# EAGLE schematic powerSupply (EAGLE 7.2.0)
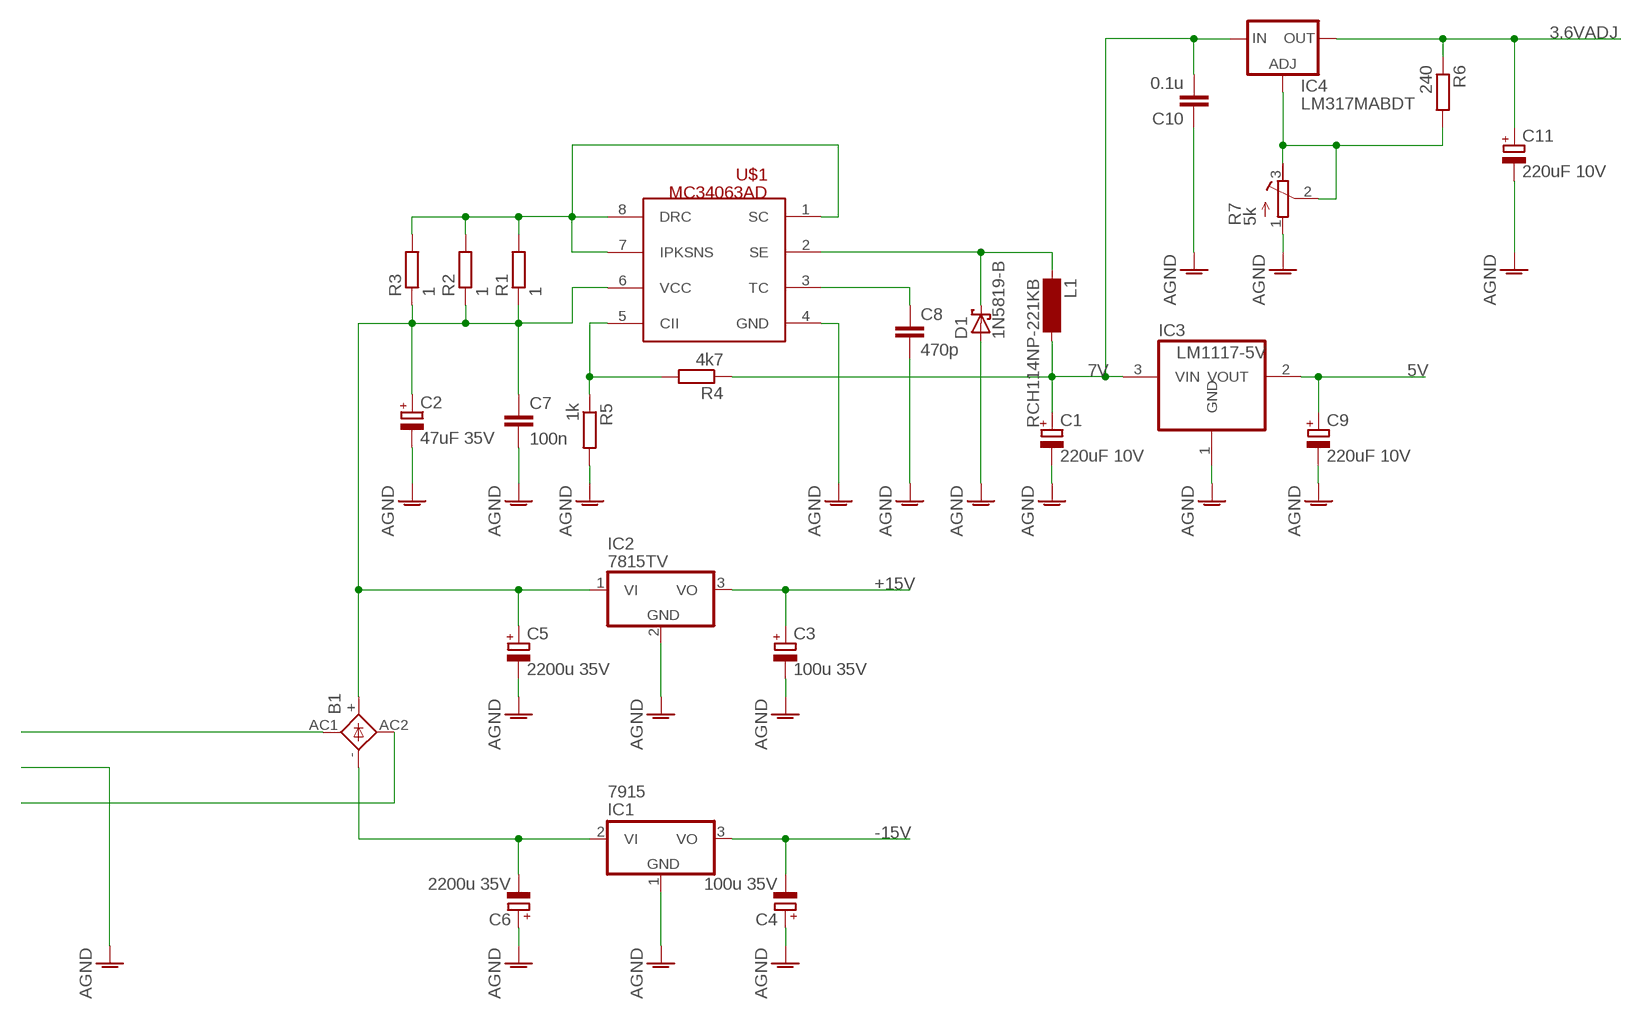
[diagram p0: schematic, sheet 1]

## Parts
B1  2KBP  [2KBP]
C1  220uF 10V  CPOL-EUUD-6,3X8,8  [UD-6,3X5,8_NICHICON]
C2  47uF 35V  CPOL-EUUD-6,3X7,7  [UD-6,3X7,7_NICHICON]
C3  100u 35V  CPOL-EUE3.5-8  [E3,5-8]
C4  100u 35V  CPOL-EUE3.5-8  [E3,5-8]
C5  2200u 35V  CPOL-EUE7.5-16  [E7,5-16]
C6  2200u 35V  CPOL-EUE7.5-16  [E7,5-16]
C7  100n  C-EUC0805  [C0805]
C8  470p  C-EUC0805  [C0805]
C9  220uF 10V  CPOL-EUUD-6,3X8,8  [UD-6,3X5,8_NICHICON]
C10  0.1u  C-EUC0805  [C0805]
C11  220uF 10V  CPOL-EUUD-6,3X8,8  [UD-6,3X5,8_NICHICON]
D1  1N5819-B  [DO41-7.6]
IC1  7915  7915V  [TO220V]
IC2  7815TV  [TO220V]
IC3  LM1117-5V  REG1117  [SOT223]
IC4  LM317MABDT  [DPACK]
L1  RCH114NP-221KB  BS11  [BS11]
R1  1  R-EU_M1206  [M1206]
R2  1  R-EU_M1206  [M1206]
R3  1  R-EU_M1206  [M1206]
R4  4k7  R-EU_M1206  [M1206]
R5  1k  R-EU_M1206  [M1206]
R6  240  R-EU_M1206  [M1206]
R7  5k  R-TRIMM3296W  [RTRIM3296W]
U$1  MC34063AD  [SO-08]

## Nets
3.6VADJ: C11.+ IC4.4(OUT) R6.1
5V: C9.+ IC3.2(VOUT)
7V: C1.+ C10.2 IC3.3(VIN) IC4.3(IN) L1.2 R4.1
+15V: C3.+ IC2.3(VO)
-15V: C4.- IC1.3(VO)
AGND: C1.- C2.- C3.- C4.+ C5.- C6.+ C7.2 C8.2 C9.- C10.1 C11.- D1.A IC1.1(GND) IC2.2(GND) IC3.1(GND) R5.2 R7.1(A) U$1.4(GND)
N$1: B1.+ C2.+ C5.+ C7.1 IC2.1(VI) R1.1 R2.1 R3.1 U$1.6(VCC)
N$2: B1.- C6.- IC1.2(VI)
N$5: B1.AC1
N$6: B1.AC2
N$8: IC4.1(ADJ) R6.2 R7.2(S) R7.3(E)
N$9: R4.2 R5.1 U$1.5(CII)
N$10: C8.1 U$1.3(TC)
N$11: D1.C L1.1 U$1.2(SE)
N$13: R1.2 R2.2 R3.2 U$1.1(SC) U$1.7(IPKSNS) U$1.8(DRC)

## Library data of the parts
B1 = rectifier:2KBP: RECTIFIER grid 3 x 3,81 mm
C1-C6 C9 C11 = rcl:CPOL-EU: POLARIZED CAPACITOR, European symbol
C7 C8 C10 = rcl:C-EU: CAPACITOR, European symbol
D1 = diode:1N581*: 1.0A SCHOTTKY BARRIER RECTIFIER Source: http://www.diodes.com/datasheets/ds23001.pdf
IC1 = linear:79*: Negative VOLTAGE REGULATOR
IC2 = linear:78*: Positive VOLTAGE REGULATOR Source: http://cache.national.com/ds/LM/LM78L05.pdf http://www.fairchildsemi.com/ds/LM/LM7805.pdf
IC3 = burr-brown:REG1117: 800mA and 1A Low Dropout (LDO) Positive Regulator 1.8V, 2.5V, 2.85V, 3.3V, 5V, and Adj; MPN: REG1117; OC_FARNELL: 1097566; OC_NEWARK: 14P6981
IC4 = v-reg:LM317?*: 500 mA Adjustable Output Positive Voltage Regulator Source: http://www.onsemi.co.jp .. LM317M-D.PDF
L1 = inductor-neosid:BS: INDUCTOR nominal inductance, magnetically screened; OC_FARNELL: unknown; OC_NEWARK: unknown
R1-R6 = rcl:R-EU_: RESISTOR, European symbol
R7 = resistor:R-TRIMM: Trimm resistor
U$1 = VoltageRegulator:MC34063A